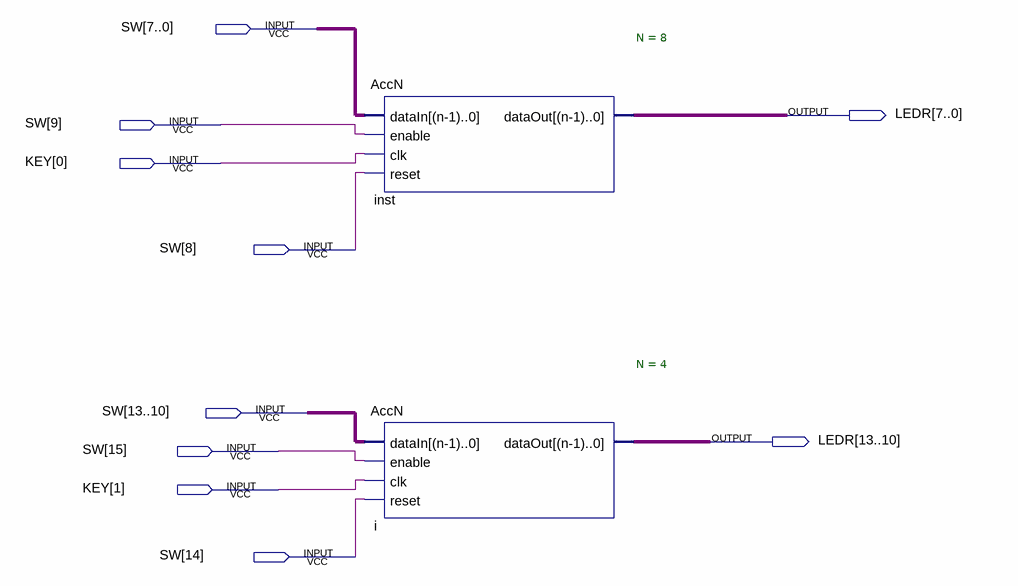
[diagram p0: schematic sheet]
// Quartus schematic AccN_Demo.bdf as structural Verilog: 2 symbols, 10 pins
module AccN_Demo (
  input  [15:0] SW,
  input  [1:0] KEY,
  output [13:0] LEDR
);

  AccN #(.N(8)) inst (.dataIn(SW[7:0]), .enable(SW[9]), .clk(KEY[0]), .reset(SW[8]), .dataOut(LEDR[7:0]));
  AccN #(.N(4)) i (.dataIn(SW[13:10]), .enable(SW[15]), .clk(KEY[1]), .reset(SW[14]), .dataOut(LEDR[13:10]));
endmodule
